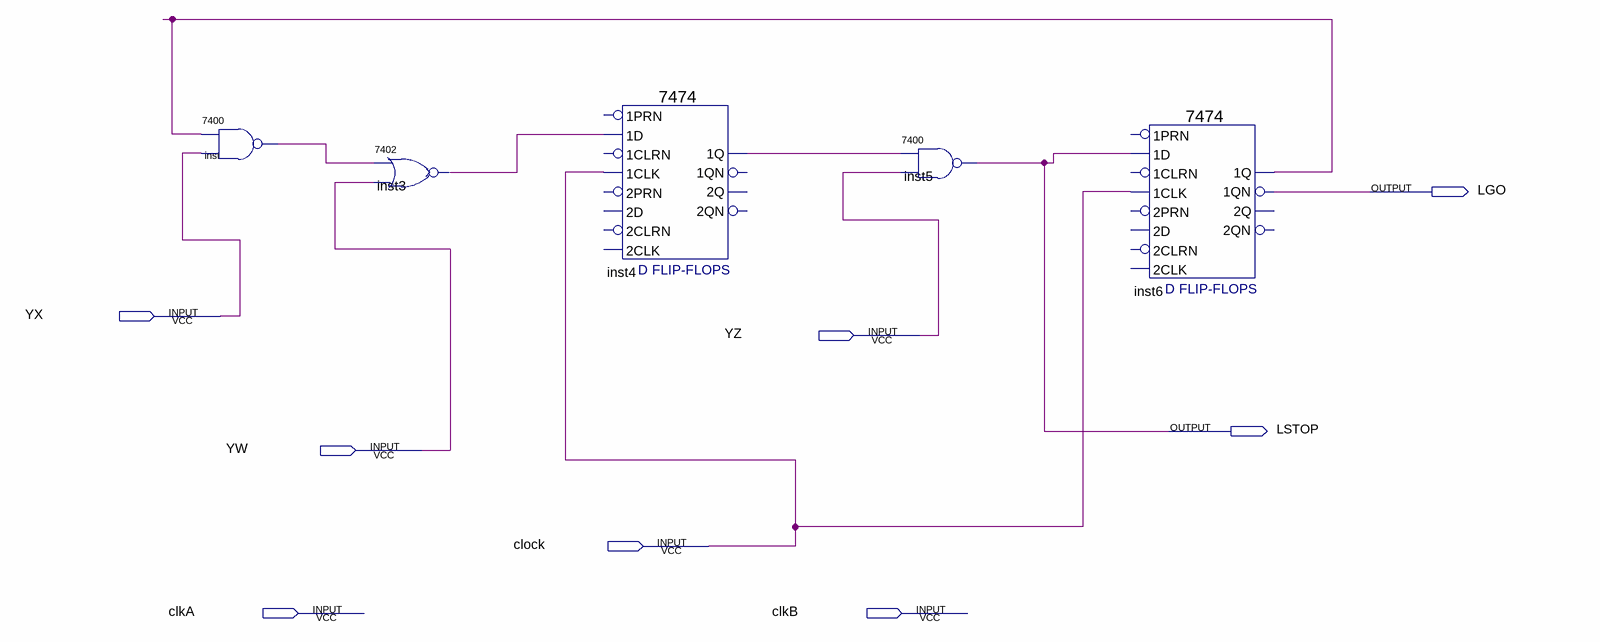
[diagram p0: schematic sheet]
// Quartus schematic Wiat513.bdf as structural Verilog: 5 symbols, 8 pins
module Wiat513 (
  input  YX,
  input  YZ,
  input  YW,
  input  clock,
  input  clkA,
  input  clkB,
  output LGO,
  output LSTOP
);

  wire inst3_1, inst4_1q, inst6_1q, inst_1;

  \7400  inst (.\3 (YX), .\2 (inst6_1q), .\1 (inst_1));
  \7402  inst3 (.\2 (inst_1), .\3 (YW), .\1 (inst3_1));
  \7474  inst4 (
    .\1CLK (clock), .\1D (inst3_1), .\1Q (inst4_1q));  // open: 2D, 2PRN, 1PRN, 2CLK, 2CLRN, 1CLRN, 1QN, 2Q, 2QN
  \7400  inst5 (.\3 (YZ), .\2 (inst4_1q), .\1 (LSTOP));
  \7474  inst6 (
    .\1CLK (clock), .\1D (LSTOP), .\1QN (LGO), .\1Q (inst6_1q));  // open: 2D, 2PRN, 1PRN, 2CLK, 2CLRN, 1CLRN, 2Q, 2QN
endmodule
